# EasyEDA schematic 6coils.json
TITLE: Sheet_1; REV: 1.0; Date: 2023-10-23; Sheet: 1/1; Company: Your Company
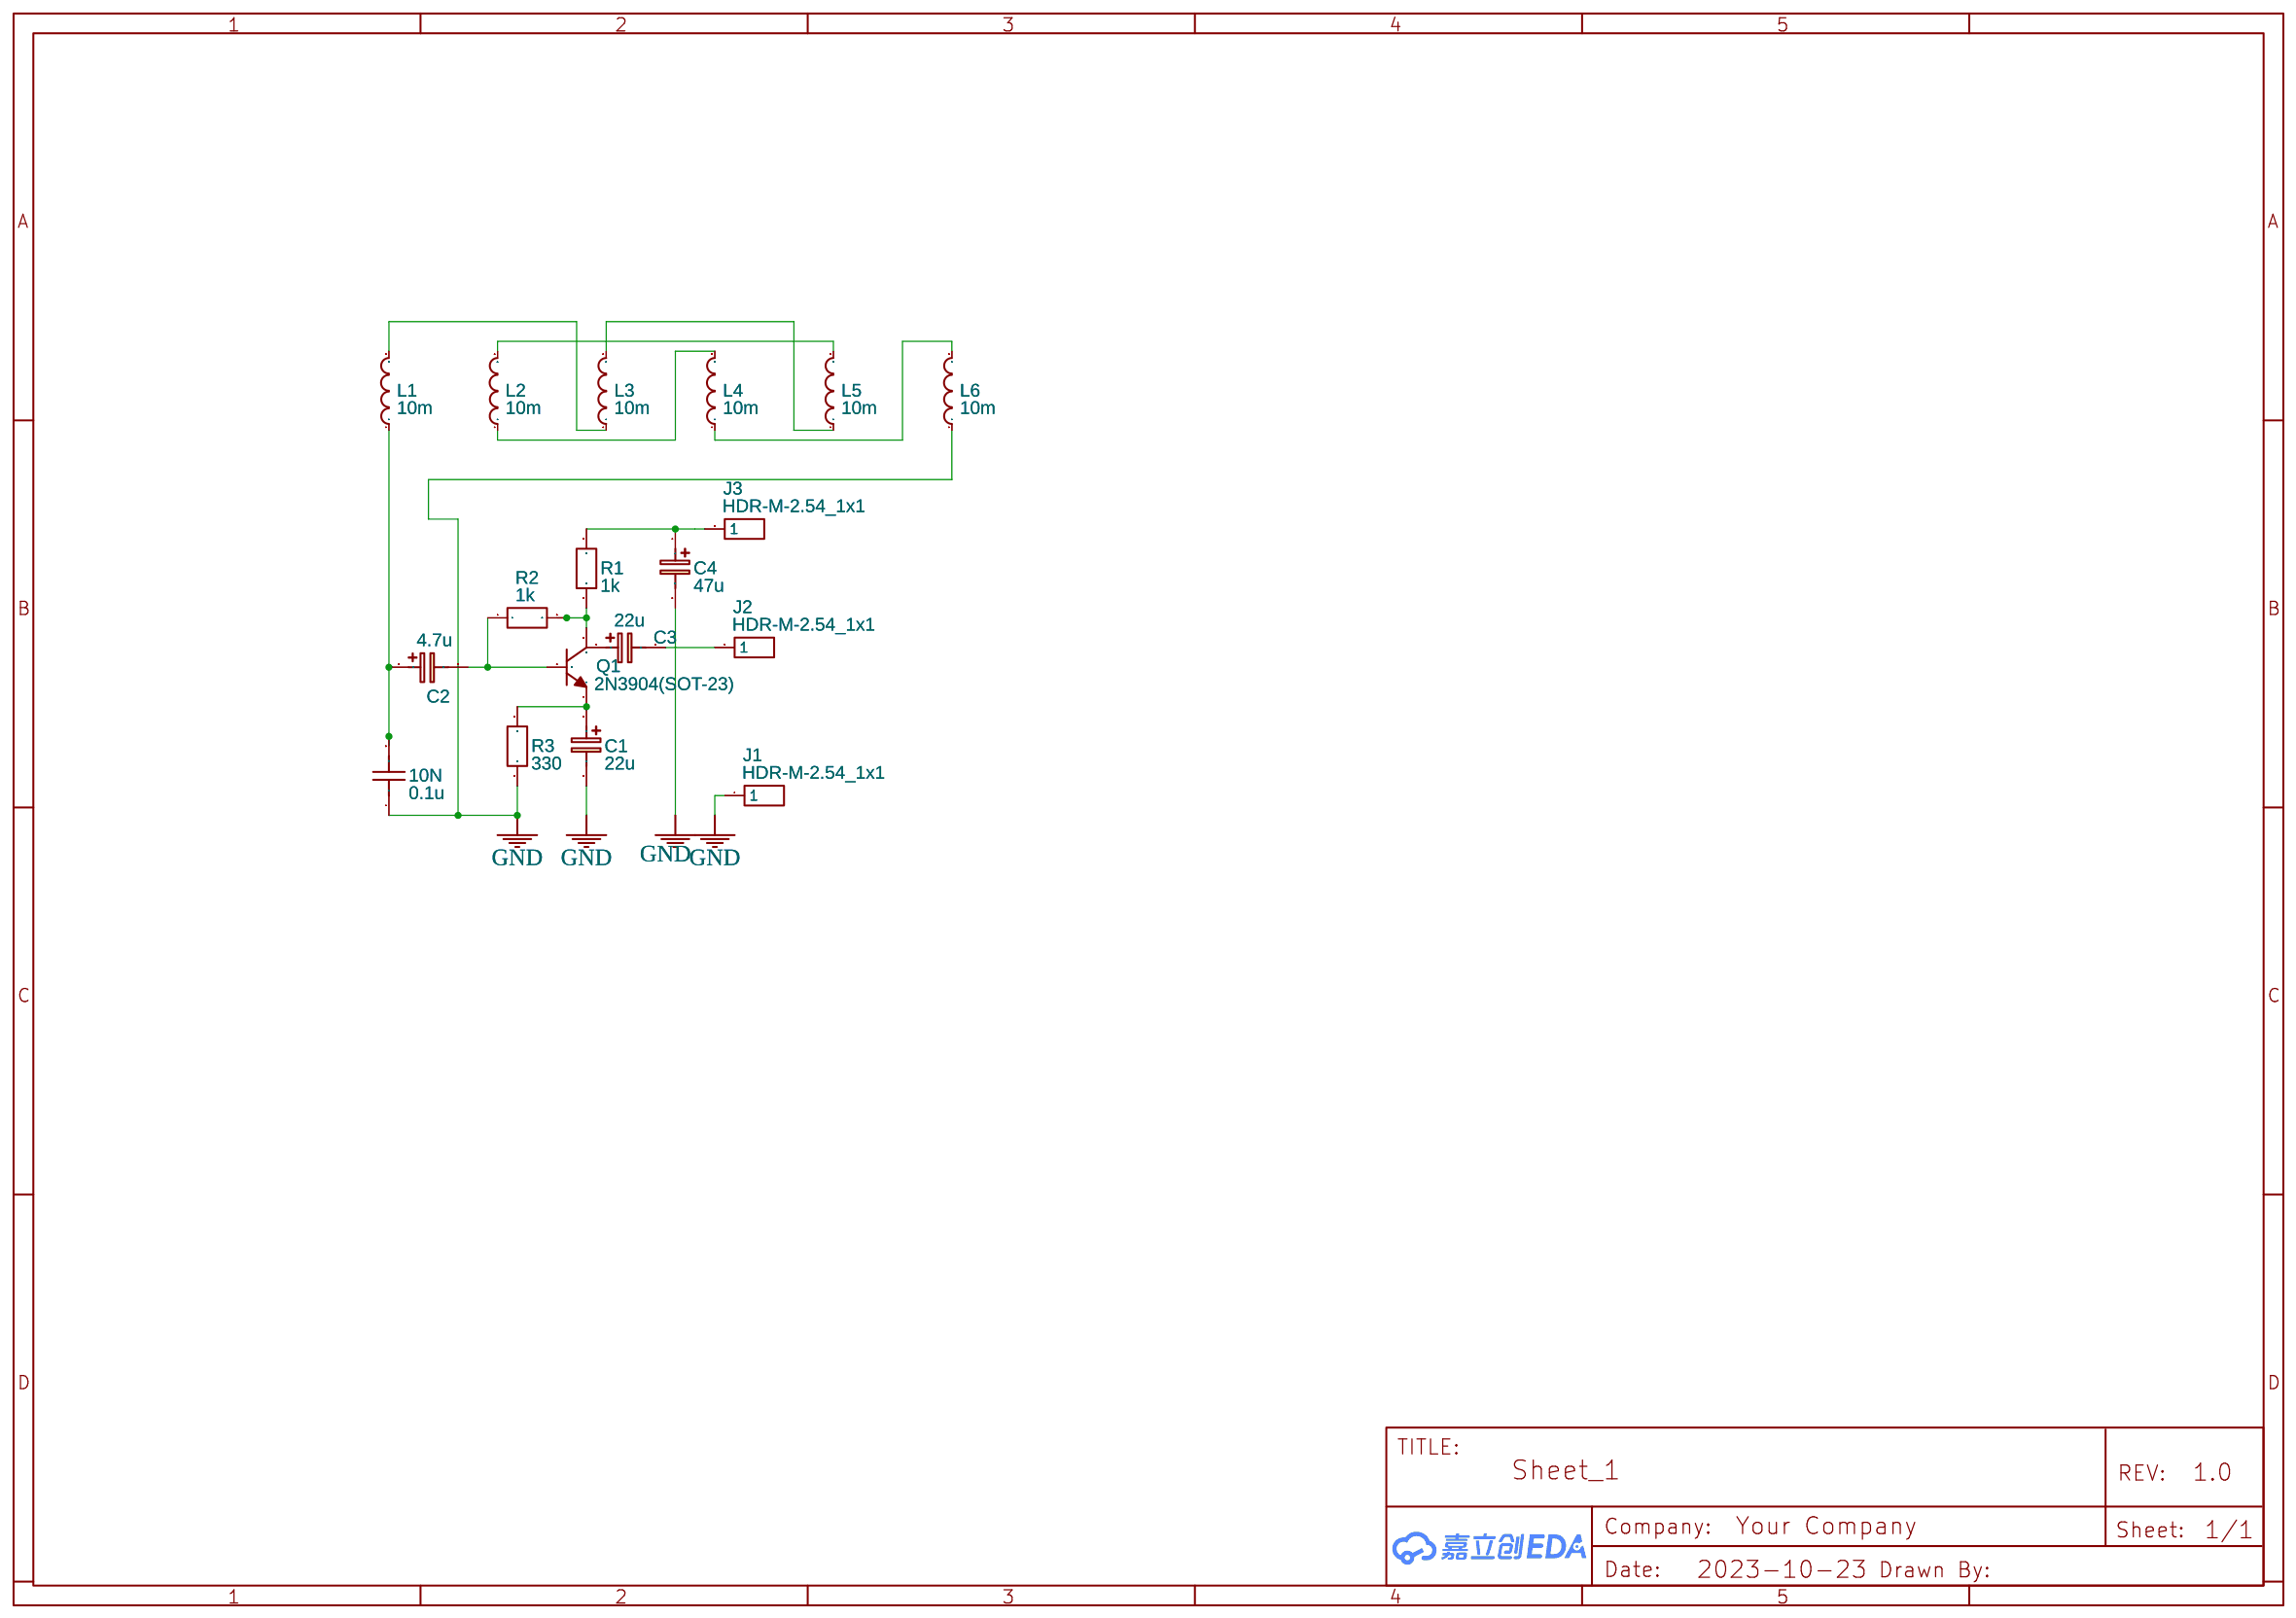
[diagram p0: schematic sheet]

## Parts
10N  0.1u  [C0603]
C1  22u  [CASE-A_3216]
C2  4.7u  [CASE-A_3216]
C3  22u  [CASE-A_3216]
C4  47u  [CASE-A_3216]
J1  HDR-M-2.54_1x1  [HDR-M-2.54_1X1]
J2  HDR-M-2.54_1x1  [HDR-M-2.54_1X1]
J3  HDR-M-2.54_1x1  [HDR-M-2.54_1X1]
L1  10m  [L0603]
L2  10m  [L0603]
L3  10m  [L0603]
L4  10m  [L0603]
L5  10m  [L0603]
L6  10m  [L0603]
Q1  2N3904(SOT-23)  [SOT-23-3_L2.9-W1.3-P1.90-LS2.4-TR]
R1  1k  [R0603]
R2  1k  [R0603]
R3  330  [R0603]

## Library data of the parts
10N = C_0603_US: Contributor: LCEDA_Lib
C1-C4 = C_Tan_SMD_A_EU: Contributor: LCEDA_Lib
J1-J3 = HDR-M-2.54_1x1: Supplier Part: C81276; Supplier: LCSC; Contributor: LCEDA_Lib
L1-L6 = L0603_US: Contributor: LCEDA_Lib
Q1 = 2N3904(SOT-23): Supplier: LCSC; Manufacturer: KEC; Manufacturer Part: 2n3904S-RTK/PS; Supplier Part: C18536; Paste Type: SOT-23; Contributor: LCEDA_Lib
R1-R3 = R_0603_EU: Contributor: LCEDA_Lib

## Nets
GND: 10N.1 C1.2 C4.2 J1.1 L6.1 R3.1
Net-(10N-2): 10N.2 C2.1 L1.1
Net-(C1-1): C1.1 Q1.1(E) R3.2
Net-(C2-2): C2.2 Q1.2(B) R2.1
Net-(C3-2): C3.2 J2.1
Net-(C4-1): C4.1 J3.1 R1.2
Net-(L1-2): L1.2 L3.1
Net-(L2-1): L2.1 L4.2
Net-(L2-2): L2.2 L5.2
Net-(L3-2): L3.2 L5.1
Net-(L4-1): L4.1 L6.2
Net-(Q1-3): Q1.3(C) R1.1 R2.2

Not connected (* = marked no-connect by the designer): C3 1
